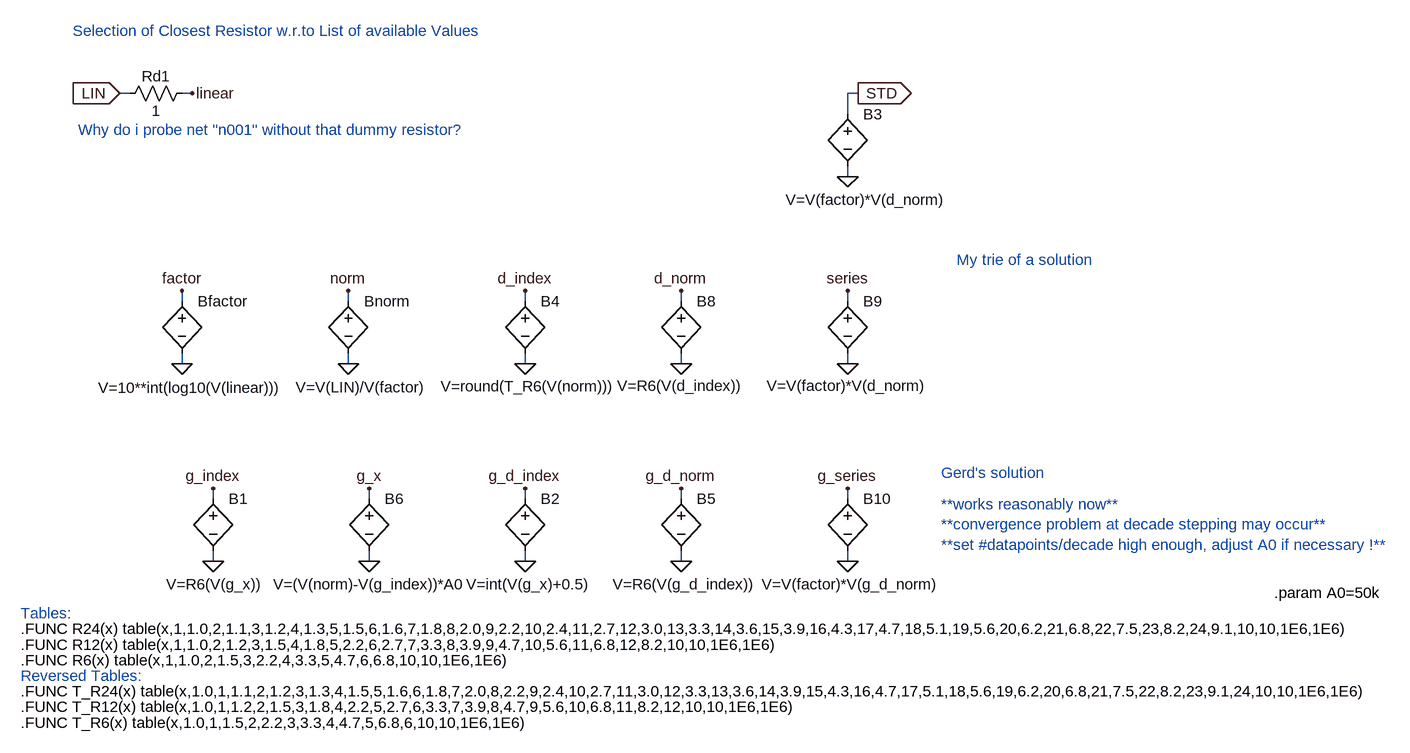
[diagram p0: schematic Eseries.asc]
Eseries.asc, the LTspice schematic file:
Version 4
SHEET 1 2628 980
WIRE 96 -160 80 -160
WIRE 176 160 176 144
WIRE 176 256 176 240
WIRE 192 -160 176 -160
WIRE 224 464 224 448
WIRE 224 560 224 544
WIRE 432 160 432 144
WIRE 432 256 432 240
WIRE 464 464 464 448
WIRE 464 560 464 544
WIRE 704 160 704 144
WIRE 704 256 704 240
WIRE 704 464 704 448
WIRE 704 560 704 544
WIRE 944 160 944 144
WIRE 944 256 944 240
WIRE 944 464 944 448
WIRE 944 560 944 544
WIRE 1200 -128 1200 -160
WIRE 1200 -32 1200 -48
WIRE 1200 160 1200 144
WIRE 1200 256 1200 240
WIRE 1200 464 1200 448
WIRE 1200 560 1200 544
WIRE 1216 -160 1200 -160
FLAG 224 560 0
FLAG 224 448 g_index
FLAG 464 448 g_x
FLAG 704 560 0
FLAG 704 448 g_d_index
FLAG 1200 -32 0
FLAG 1216 -160 STD
IOPIN 1216 -160 Out
FLAG 432 256 0
FLAG 432 144 norm
FLAG 176 256 0
FLAG 176 144 factor
FLAG 464 560 0
FLAG 80 -160 LIN
IOPIN 80 -160 In
FLAG 704 256 0
FLAG 704 144 d_index
FLAG 944 256 0
FLAG 944 144 d_norm
FLAG 944 560 0
FLAG 944 448 g_d_norm
FLAG 192 -160 linear
FLAG 1200 256 0
FLAG 1200 144 series
FLAG 1200 560 0
FLAG 1200 448 g_series
SYMBOL bv 224 448 R0
WINDOW 3 2 147 Center 0
SYMATTR Value V=R6(V(g_x))
SYMATTR InstName B1
SYMBOL bv 704 448 R0
WINDOW 3 5 147 Center 0
SYMATTR Value V=int(V(g_x)+0.5)
SYMATTR InstName B2
SYMBOL bv 1200 -144 R0
WINDOW 3 28 148 Center 0
SYMATTR Value V=V(factor)*V(d_norm)
SYMATTR InstName B3
SYMBOL bv 432 144 R0
WINDOW 3 19 148 Center 0
SYMATTR Value V=V(LIN)/V(factor)
SYMATTR InstName Bnorm
SYMBOL bv 176 144 R0
WINDOW 3 13 149 Center 0
SYMATTR Value V=10**int(log10(V(linear)))
SYMATTR InstName Bfactor
SYMBOL bv 464 448 R0
WINDOW 3 1 147 Center 0
SYMATTR Value V=(V(norm)-V(g_index))*A0
SYMATTR InstName B6
SYMBOL bv 704 144 R0
WINDOW 3 6 147 Center 0
SYMATTR Value V=round(T_R6(V(norm)))
SYMATTR InstName B4
SYMBOL bv 944 144 R0
WINDOW 3 -1 146 Center 0
SYMATTR Value V=R6(V(d_index))
SYMATTR InstName B8
SYMBOL bv 944 448 R0
WINDOW 3 5 147 Center 0
SYMATTR Value V=R6(V(g_d_index))
SYMATTR InstName B5
SYMBOL res 192 -176 R90
WINDOW 0 5 56 VBottom 0
WINDOW 3 27 56 VTop 0
SYMATTR InstName Rd1
SYMATTR Value 1
SYMBOL bv 1200 144 R0
WINDOW 3 -1 146 Center 0
SYMATTR Value V=V(factor)*V(d_norm)
SYMATTR InstName B9
SYMBOL bv 1200 448 R0
WINDOW 3 5 147 Center 0
SYMATTR Value V=V(factor)*V(g_d_norm)
SYMATTR InstName B10
TEXT 8 -256 Left 0 ;Selection of Closest Resistor w.r.to List of available Values
TEXT 1856 608 Left 0 !.param A0=50k
TEXT -72 664 Left 0 !.FUNC R24(x) table(x,1,1.0,2,1.1,3,1.2,4,1.3,5,1.5,6,1.6,7,1.8,8,2.0,9,2.2,10,2.4,11,2.7,12,3.0,13,3.3,14,3.6,15,3.9,16,4.3,17,4.7,18,5.1,19,5.6,20,6.2,21,6.8,22,7.5,23,8.2,24,9.1,10,10,1E6,1E6)
TEXT -72 688 Left 0 !.FUNC R12(x) table(x,1,1.0,2,1.2,3,1.5,4,1.8,5,2.2,6,2.7,7,3.3,8,3.9,9,4.7,10,5.6,11,6.8,12,8.2,10,10,1E6,1E6)
TEXT -72 712 Left 0 !.FUNC R6(x) table(x,1,1.0,2,1.5,3,2.2,4,3.3,5,4.7,6,6.8,10,10,1E6,1E6)
TEXT -72 808 Left 0 !.FUNC T_R6(x) table(x,1.0,1,1.5,2,2.2,3,3.3,4,4.7,5,6.8,6,10,10,1E6,1E6)
TEXT -72 736 Left 0 ;Reversed Tables:
TEXT -72 784 Left 0 !.FUNC T_R12(x) table(x,1.0,1,1.2,2,1.5,3,1.8,4,2.2,5,2.7,6,3.3,7,3.9,8,4.7,9,5.6,10,6.8,11,8.2,12,10,10,1E6,1E6)
TEXT -72 760 Left 0 !.FUNC T_R24(x) table(x,1.0,1,1.1,2,1.2,3,1.3,4,1.5,5,1.6,6,1.8,7,2.0,8,2.2,9,2.4,10,2.7,11,3.0,12,3.3,13,3.6,14,3.9,15,4.3,16,4.7,17,5.1,18,5.6,19,6.2,20,6.8,21,7.5,22,8.2,23,9.1,24,10,10,1E6,1E6)
TEXT -72 640 Left 0 ;Tables:
TEXT 1344 424 Left 0 ;Gerd's solution
TEXT 1368 96 Left 0 ;My trie of a solution
TEXT 16 -104 Left 0 ;Why do i probe net "n001" without that dummy resistor?
TEXT 1344 472 Left 0 ;**works reasonably now**\n**convergence problem at decade stepping may occur**\n**set #datapoints/decade high enough, adjust A0 if necessary !**

The netlist it stands for:
* Eseries.asc
B1 g_index 0 V=R6(V(g_x))
B2 g_d_index 0 V=int(V(g_x)+0.5)
B3 STD 0 V=V(factor)*V(d_norm)
Bnorm norm 0 V=V(LIN)/V(factor)
Bfactor factor 0 V=10**int(log10(V(linear)))
B6 g_x 0 V=(V(norm)-V(g_index))*A0
B4 d_index 0 V=round(T_R6(V(norm)))
B8 d_norm 0 V=R6(V(d_index))
B5 g_d_norm 0 V=R6(V(g_d_index))
Rd1 linear LIN 1
B9 series 0 V=V(factor)*V(d_norm)
B10 g_series 0 V=V(factor)*V(g_d_norm)
* Selection of Closest Resistor w.r.to List of available Values
.param A0=50k
.FUNC R24(x) table(x,1,1.0,2,1.1,3,1.2,4,1.3,5,1.5,6,1.6,7,1.8,8,2.0,9,2.2,10,2.4,11,2.7,12,3.0,13,3.3,14,3.6,15,3.9,16,4.3,17,4.7,18,5.1,19,5.6,20,6.2,21,6.8,22,7.5,23,8.2,24,9.1,10,10,1E6,1E6)
.FUNC R12(x) table(x,1,1.0,2,1.2,3,1.5,4,1.8,5,2.2,6,2.7,7,3.3,8,3.9,9,4.7,10,5.6,11,6.8,12,8.2,10,10,1E6,1E6)
.FUNC R6(x) table(x,1,1.0,2,1.5,3,2.2,4,3.3,5,4.7,6,6.8,10,10,1E6,1E6)
.FUNC T_R6(x) table(x,1.0,1,1.5,2,2.2,3,3.3,4,4.7,5,6.8,6,10,10,1E6,1E6)
* Reversed Tables:
.FUNC T_R12(x) table(x,1.0,1,1.2,2,1.5,3,1.8,4,2.2,5,2.7,6,3.3,7,3.9,8,4.7,9,5.6,10,6.8,11,8.2,12,10,10,1E6,1E6)
.FUNC T_R24(x) table(x,1.0,1,1.1,2,1.2,3,1.3,4,1.5,5,1.6,6,1.8,7,2.0,8,2.2,9,2.4,10,2.7,11,3.0,12,3.3,13,3.6,14,3.9,15,4.3,16,4.7,17,5.1,18,5.6,19,6.2,20,6.8,21,7.5,22,8.2,23,9.1,24,10,10,1E6,1E6)
* Tables:
* Gerd's solution
* My trie of a solution
* Why do i probe net "n001" without that dummy resistor?
* **works reasonably now**
* **convergence problem at decade stepping may occur**
* **set #datapoints/decade high enough, adjust A0 if necessary !**
.backanno
.end